# EasyEDA schematic EasyEDAProject.json
TITLE: ESP Cloud Remote; REV: 0.3; Date: 16.10.2024; Sheet: 1/1
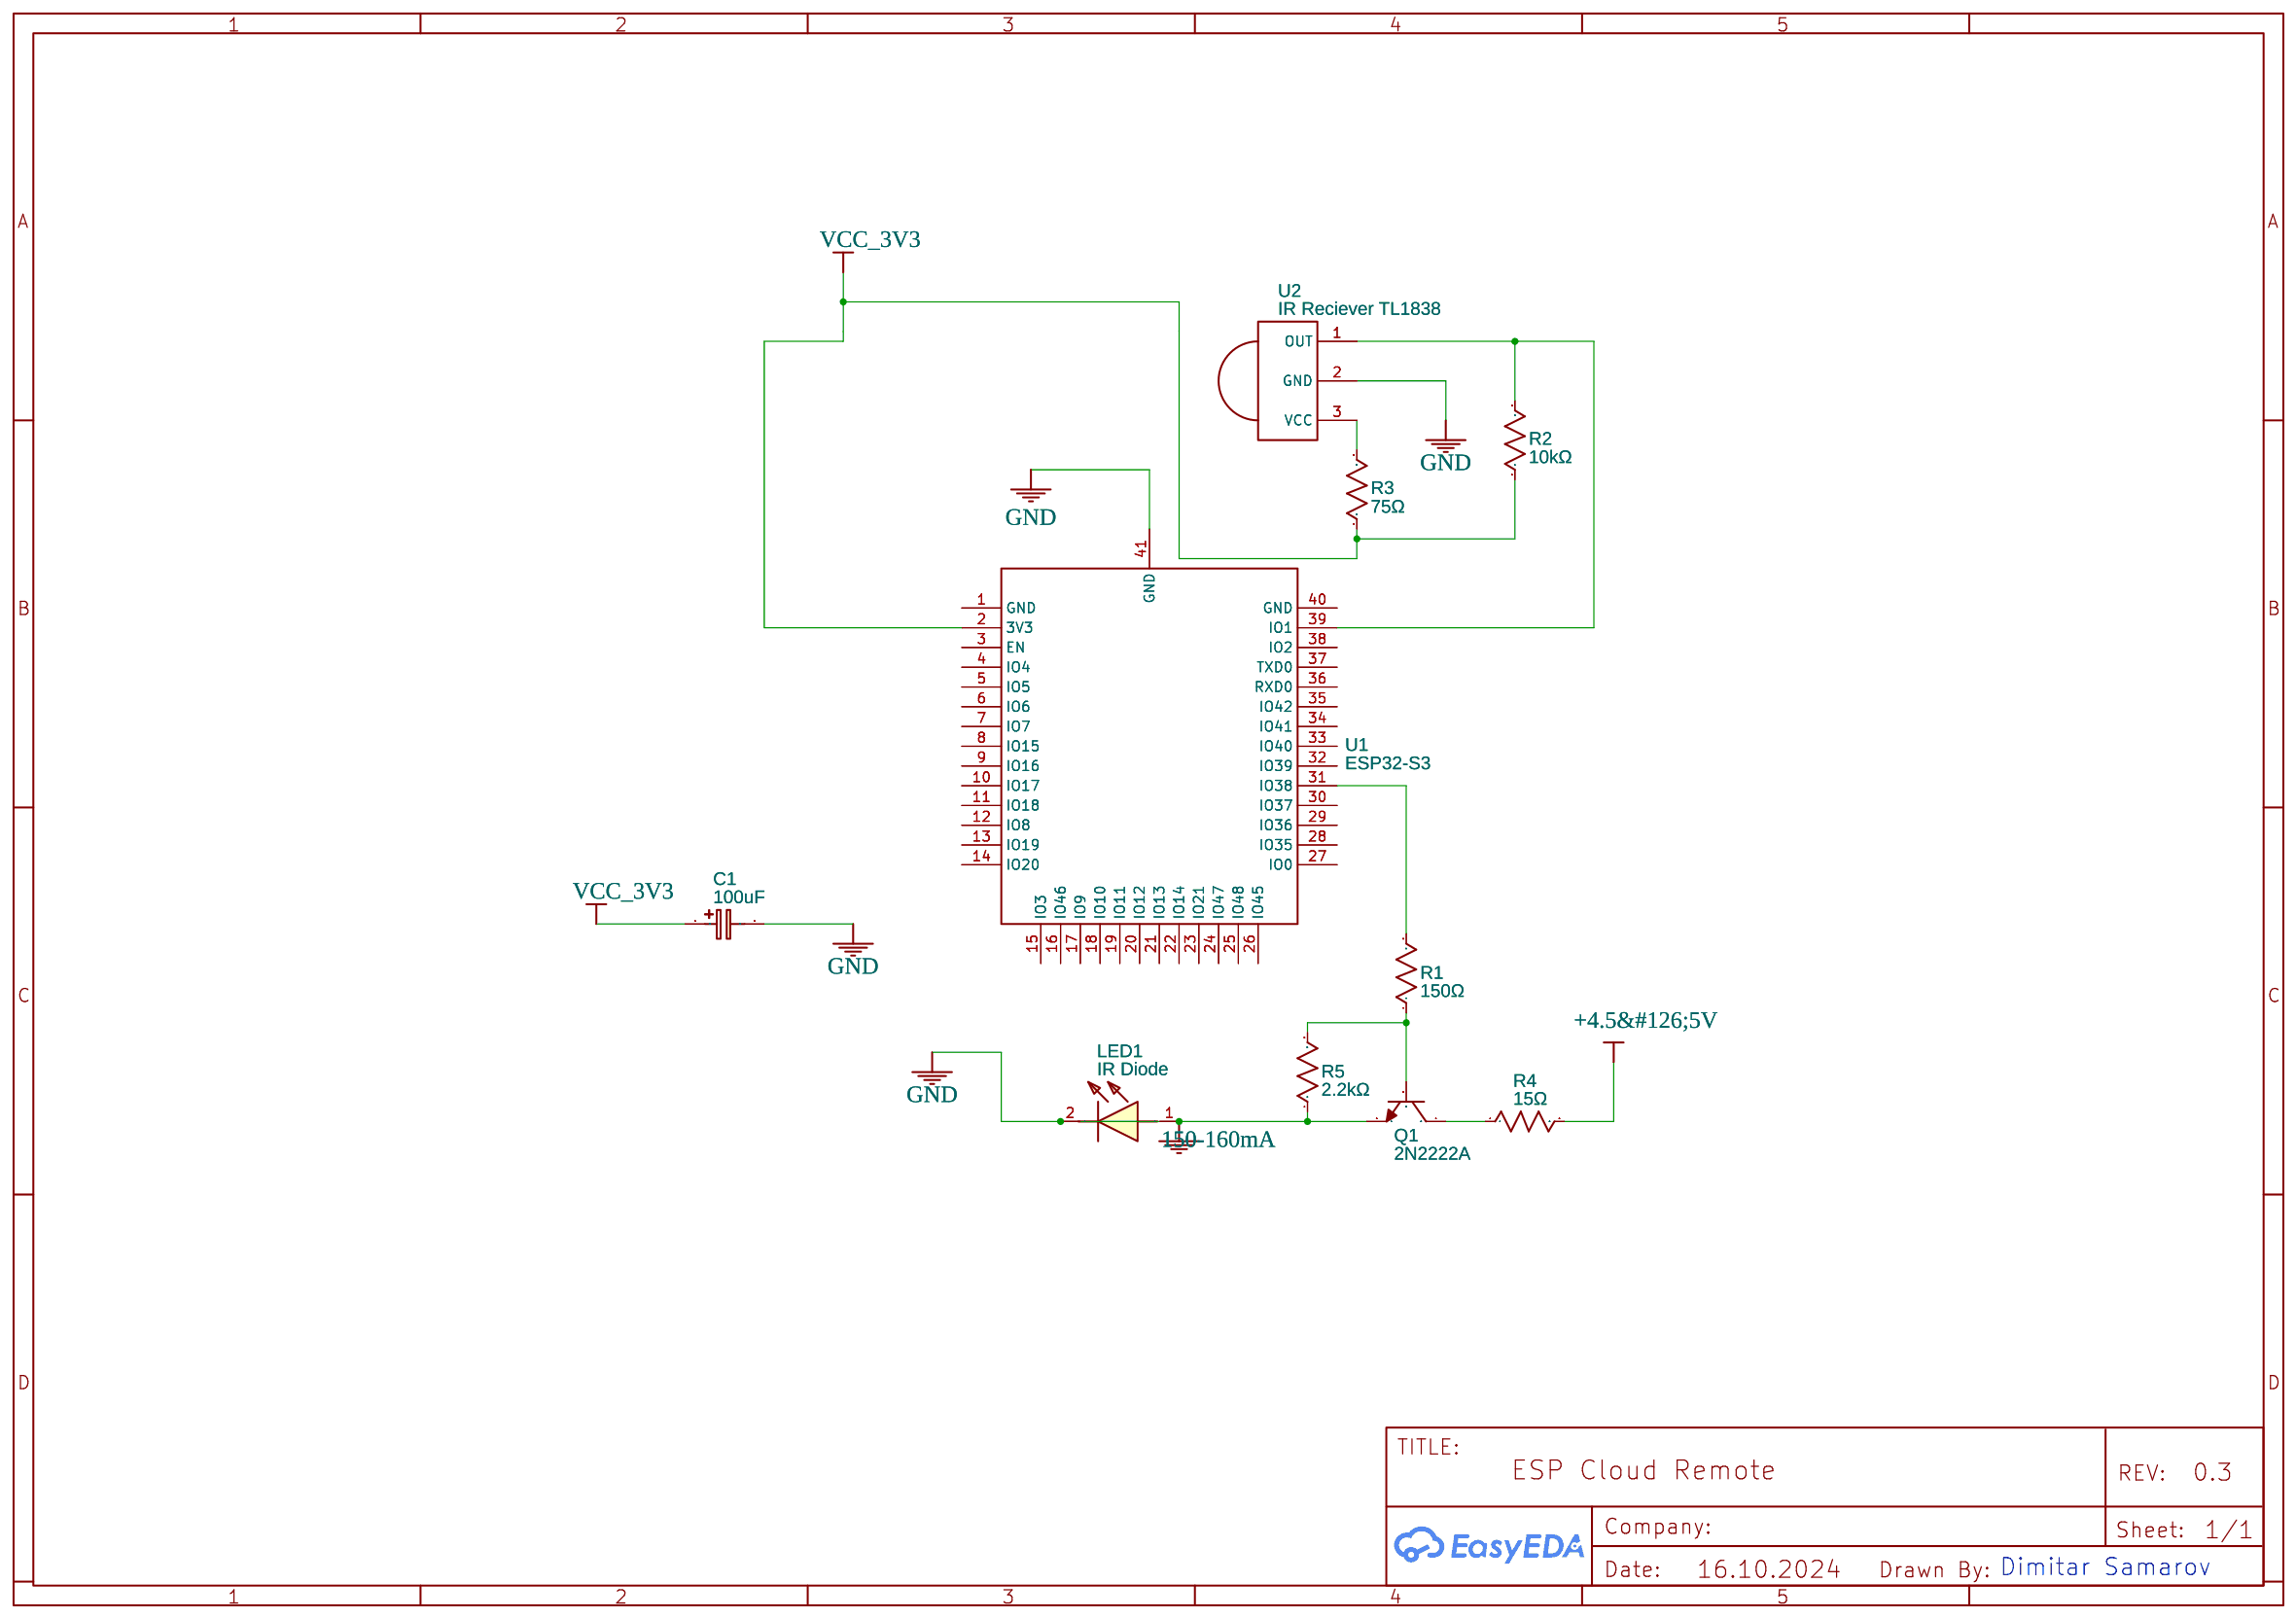
[diagram p0: schematic sheet]

## Parts
C1  100uF  [CASE-A_3216]
LED1  IR Diode  [IR333A]
Q1  2N2222A  [TO-92-3_L4.8-W3.7-P2.54-R]
R1  150Ω  [R0603]
R2  10kΩ  [R0603]
R3  75Ω  [R0603]
R4  15Ω  [R0603]
R5  2.2kΩ  [R0603]
U1  ESP32-S3  [WIRELM-SMD_ESP32-S3-WROOM-1U]
U2  IR Reciever TL1838  [TL1838]

## Library data of the parts
C1 = C_Tan_SMD_A_EU: Contributor: LCEDA_Lib
LED1 = IR333-A: Contributor: maitripatel0410
Q1 = 2N2222A: Contributor: LCSC; Supplier: LCSC; Supplier Part: C358533; Manufacturer: BLUE ROCKET(蓝箭); JLCPCB Part Class: Extended Part
R1-R5 = R_0603_US: Contributor: LCEDA_Lib
U1 = ESP32-S3-WROOM-1U-N4: Contributor: LCSC; Supplier: LCSC; Supplier Part: C2980296; Manufacturer: ESPRESSIF(乐鑫); JLCPCB Part Class: Extended Part
U2 = TL1838: Contributor: karelgomez124

## Nets
VCC_3V3: C1.1 R2.1 R3.1 U1.2(3V3)
150-160mA: C1.2 LED1.1(A) LED1.2(K) Q1.3(E) R5.1 U1.41(GND) U2.2(GND)
+4.5&#126;5V: R4.2
Net-(Q1-1): Q1.1(C) R4.1
Net-(Q1-2): Q1.2(B) R1.1 R5.2
Net-(R1-2): R1.2 U1.31(IO38)
Net-(R2-2): R2.2 U1.39(IO1) U2.1(OUT)
Net-(R3-2): R3.2 U2.3(VCC)

Not connected (* = marked no-connect by the designer): U1 1(GND) 3(EN) 4(IO4) 5(IO5) 6(IO6) 7(IO7) 8(IO15) 9(IO16) 10(IO17) 11(IO18) 12(IO8) 13(IO19) 14(IO20) 15(IO3) 16(IO46) 17(IO9) 18(IO10) 19(IO11) 20(IO12) 21(IO13) 22(IO14) 23(IO21) 24(IO47) 25(IO48) 26(IO45) 27(IO0) 28(IO35) 29(IO36) 30(IO37) 32(IO39) 33(IO40) 34(IO41) 35(IO42) 36(RXD0) 37(TXD0) 38(IO2) 40(GND)

## Notes on the sheet
- Dimitar Samarov
